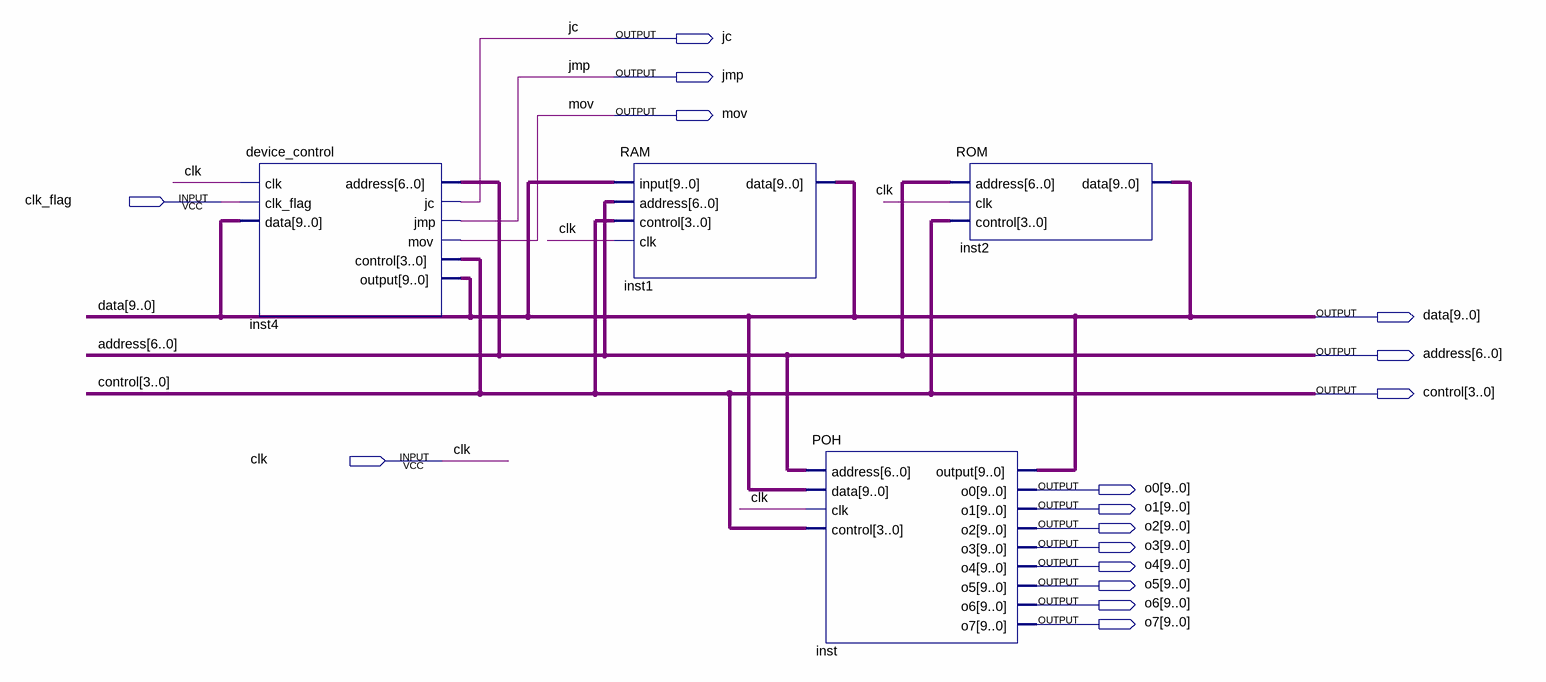
[diagram p0: schematic sheet]
// Quartus schematic main.bdf as structural Verilog: 4 symbols, 16 pins
module main (
  input  clk_flag,
  input  clk,
  output jc,
  output jmp,
  output mov,
  output [9:0] data,
  output [6:0] address,
  output [3:0] control,
  output [9:0] o0,
  output [9:0] o1,
  output [9:0] o2,
  output [9:0] o3,
  output [9:0] o4,
  output [9:0] o5,
  output [9:0] o6,
  output [9:0] o7
);

  device_control inst4 (
    .clk(clk), .clk_flag(clk_flag), .data(data), .address(address), .jc(jc), .jmp(jmp), .mov(mov),
    .control(control), .\output (data));
  RAM inst1 (.\input (data), .address(address), .control(control), .clk(clk), .data(data));
  POH inst (
    .address(address), .data(data), .clk(clk), .control(control), .\output (data), .o0(o0), .o1(o1), .o2(o2),
    .o3(o3), .o4(o4), .o5(o5), .o6(o6), .o7(o7));
  ROM inst2 (.address(address), .clk(clk), .control(control), .data(data));
endmodule
